# Altium schematic sheet Controle Moteurs.SchDoc
size A4
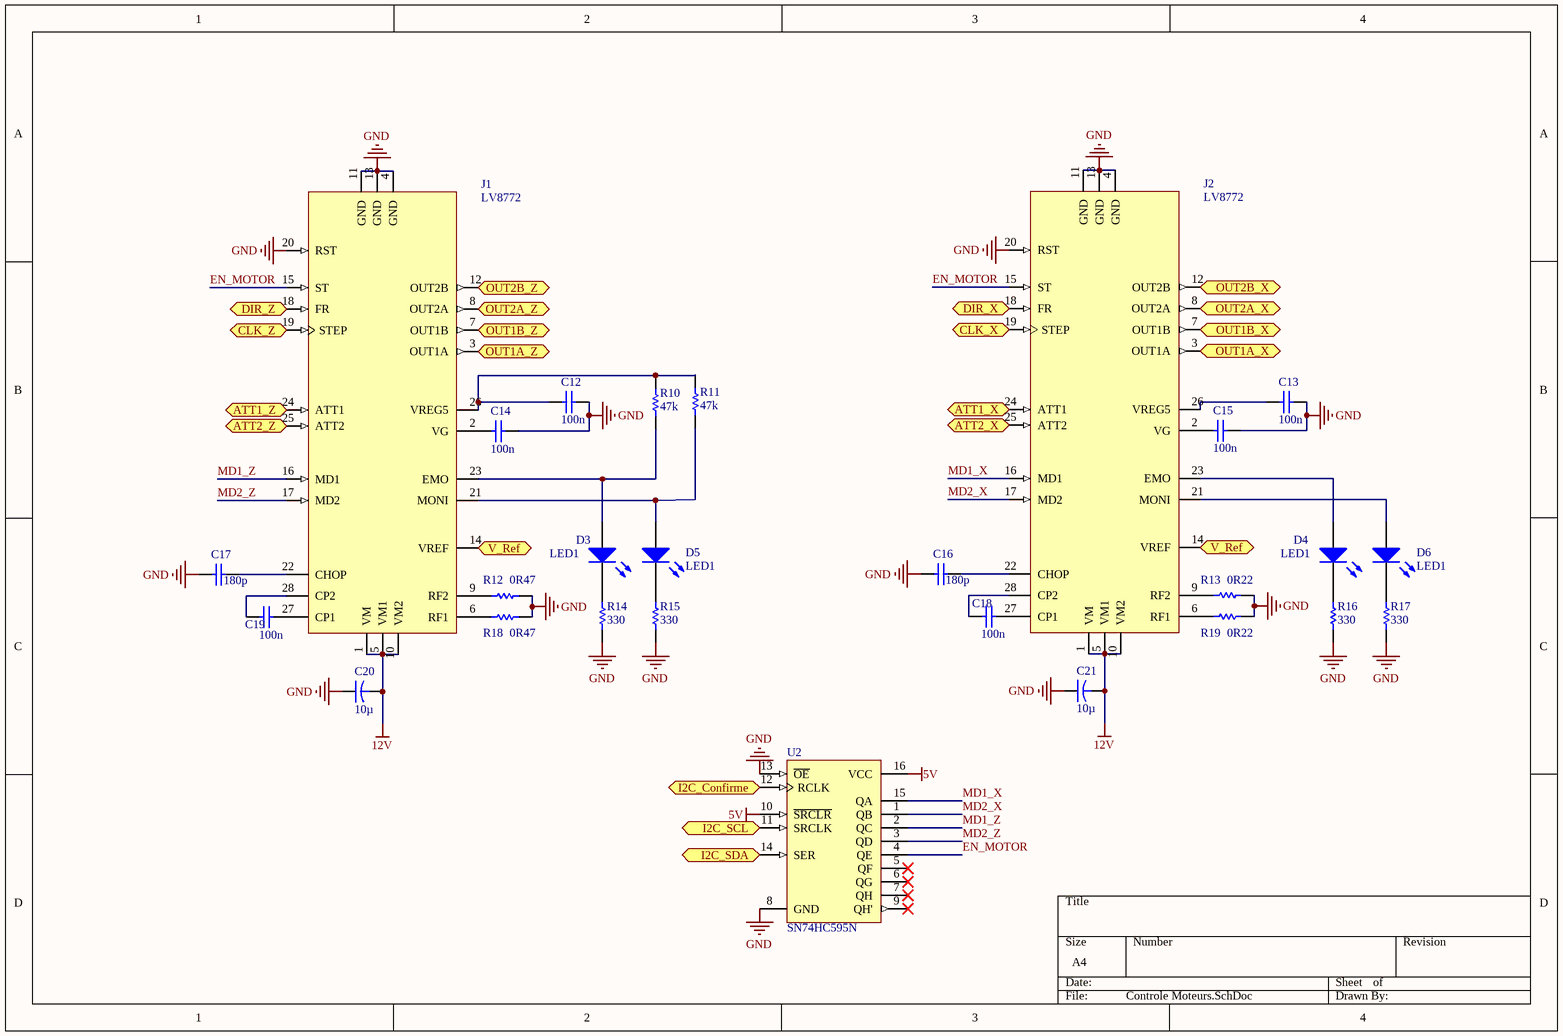
[diagram p0: Controle Moteurs.SchDoc]

## Parts
C12  value 100n  [RAD-0.3]  (hidden comment: Cap)
C13  value 100n  [RAD-0.3]  (hidden comment: Cap)
C14  value 100n  [RAD-0.3]  (hidden comment: Cap)
C15  value 100n  [RAD-0.3]  (hidden comment: Cap)
C16  value 180p  [RAD-0.3]  (hidden comment: Cap)
C17  value 180p  [RAD-0.3]  (hidden comment: Cap)
C18  value 100n  [RAD-0.3]  (hidden comment: Cap)
C19  value 100n  [RAD-0.3]  (hidden comment: Cap)
C20  value 10µ  [CAPR5-4X5]  (hidden comment: Cap2)
C21  value 10µ  [CAPR5-4X5]  (hidden comment: Cap2)
D3  LED1  [C0805]
D4  LED1  [C0805]
D5  LED1  [C0805]
D6  LED1  [C0805]
J1  LV8772
J2  LV8772
R10  value 47k  [AXIAL-0.3]  (hidden comment: Res1)
R11  value 47k  [AXIAL-0.3]  (hidden comment: Res1)
R12  value 0R47  [AXIAL-0.3]  (hidden comment: Res1)
R13  value 0R22  [AXIAL-0.3]  (hidden comment: Res1)
R14  value 330  [AXIAL-0.3]  (hidden comment: Res1)
R15  value 330  [AXIAL-0.3]  (hidden comment: Res1)
R16  value 330  [AXIAL-0.3]  (hidden comment: Res1)
R17  value 330  [AXIAL-0.3]  (hidden comment: Res1)
R18  value 0R47  [AXIAL-0.3]  (hidden comment: Res1)
R19  value 0R22  [AXIAL-0.3]  (hidden comment: Res1)
U2  SN74HC595N  [N016]

## Ports
ATT1_X, ATT1_Z, ATT2_X, ATT2_Z, CLK_X, CLK_Z, DIR_X, DIR_Z, I2C_Confirme, I2C_SCL, I2C_SDA, OUT1A_X, OUT1A_Z, OUT1B_X, OUT1B_Z, OUT2A_X, OUT2A_Z, OUT2B_X, OUT2B_Z, V_Ref

## Nets
5V: U2.10(~{SRCLR}) U2.16(VCC)
12V: C20.2 C21.2 J1.1(VM) J1.5(VM1) J1.10(VM2) J2.1(VM) J2.5(VM1) J2.10(VM2)
GND: C12.2 C13.2 C14.1 C15.1 C16.2 C17.2 C20.1 C21.1 J1.4(GND) J1.11(GND) J1.13(GND) J1.20(RST) J2.4(GND) J2.11(GND) J2.13(GND) J2.20(RST) R12.1 R13.1 R14.2 R15.2 R16.2 R17.2 R18.1 R19.1 U2.8(GND) U2.13(~{OE})
ATT1_X: J2.24(ATT1) ; port ATT1_X
ATT1_Z: J1.24(ATT1) ; port ATT1_Z
ATT2_X: J2.25(ATT2) ; port ATT2_X
ATT2_Z: J1.25(ATT2) ; port ATT2_Z
CLK_X: J2.19(STEP) ; port CLK_X
CLK_Z: J1.19(STEP) ; port CLK_Z
DIR_X: J2.18(FR) ; port DIR_X
DIR_Z: J1.18(FR) ; port DIR_Z
EN_MOTOR: J1.15(ST) J2.15(ST) U2.4(QE)
I2C_Confirme: U2.12(RCLK) ; port I2C_Confirme
I2C_SCL: U2.11(SRCLK) ; port I2C_SCL
I2C_SDA: U2.14(SER) ; port I2C_SDA
MD1_X: J2.16(MD1) U2.15(QA)
MD1_Z: J1.16(MD1) U2.2(QC)
MD2_X: J2.17(MD2) U2.1(QB)
MD2_Z: J1.17(MD2) U2.3(QD)
OUT1A_X: J2.3(OUT1A) ; port OUT1A_X
OUT1A_Z: J1.3(OUT1A) ; port OUT1A_Z
OUT1B_X: J2.7(OUT1B) ; port OUT1B_X
OUT1B_Z: J1.7(OUT1B) ; port OUT1B_Z
OUT2A_X: J2.8(OUT2A) ; port OUT2A_X
OUT2A_Z: J1.8(OUT2A) ; port OUT2A_Z
OUT2B_X: J2.12(OUT2B) ; port OUT2B_X
OUT2B_Z: J1.12(OUT2B) ; port OUT2B_Z
V_Ref: J1.14(VREF) J2.14(VREF) ; port V_Ref
NetC12_1: C12.1 J1.26(VREG5) R10.1 R11.1
NetC13_1: C13.1 J2.26(VREG5)
NetC14_2: C14.2 J1.2(VG)
NetC15_2: C15.2 J2.2(VG)
NetC16_1: C16.1 J2.22(CHOP)
NetC17_1: C17.1 J1.22(CHOP)
NetC18_1: C18.1 J2.27(CP1)
NetC18_2: C18.2 J2.28(CP2)
NetC19_1: C19.1 J1.27(CP1)
NetC19_2: C19.2 J1.28(CP2)
NetD3_1: D3.1(A) J1.23(EMO) R10.2
NetD3_2: D3.2(K) R14.1
NetD4_1: D4.1(A) J2.23(EMO)
NetD4_2: D4.2(K) R16.1
NetD5_1: D5.1(A) J1.21(MONI) R11.2
NetD5_2: D5.2(K) R15.1
NetD6_1: D6.1(A) J2.21(MONI)
NetD6_2: D6.2(K) R17.1
NetJ1_6: J1.6(RF1) R18.2
NetJ1_9: J1.9(RF2) R12.2
NetJ2_6: J2.6(RF1) R19.2
NetJ2_9: J2.9(RF2) R13.2

Not connected (* = marked no-connect by the designer): U2 5(QF)* 6(QG)* 7(QH)* 9(QH')*

## Library data of the parts
C12-C19 = Cap: Capacitor; Published: 8-Jun-2000; LatestRevisionDate: 17-Jul-2002; LatestRevisionNote: Re-released for DXP Platform.; PackageReference: RAD-0.3; Publisher: Altium Limited
C20 C21 = Cap2: Capacitor; Published: 23-Sep-2002; PackageReference: CAPR5-4X5; Publisher: Altium Limited
D3-D6 = LED1: Typical RED GaAs LED; Published: 8-Jun-2000; LatestRevisionDate: 08-Jul-2005; LatestRevisionNote: Mech Layer 1 removed.; PackageReference: LED-1; Publisher: Altium Limited
R10-R19 = Res1: Resistor; Published: 8-Jun-2000; LatestRevisionDate: 17-Jul-2002; LatestRevisionNote: Re-released for DXP Platform.; PackageReference: AXIAL-0.3; Publisher: Altium Limited
U2 = SN74HC595N: 8-Bit Shift Register with 3-State Output Registers; Published: 8-Jun-2000; LatestRevisionDate: 04-Mar-2005; LatestRevisionNote: Stylized 3D Model Added.; DatasheetVersion: May-1997; PackageVersion: Oct-1995; PackageReference: N016; Publisher: Altium Limited; PackageDescription: DIP; 16 Leads; Row Spacing 7.62 mm; Pitch 2.54 mm; Code_JEDEC: MS-001-BB; ComponentLink1Description: Manufacturer Link; ComponentLink1URL: http://www.ti.com/; ComponentLink2Description: Datasheet; ComponentLink2URL: http://www-s.ti.com/sc/ds/sn74hc595.pdf